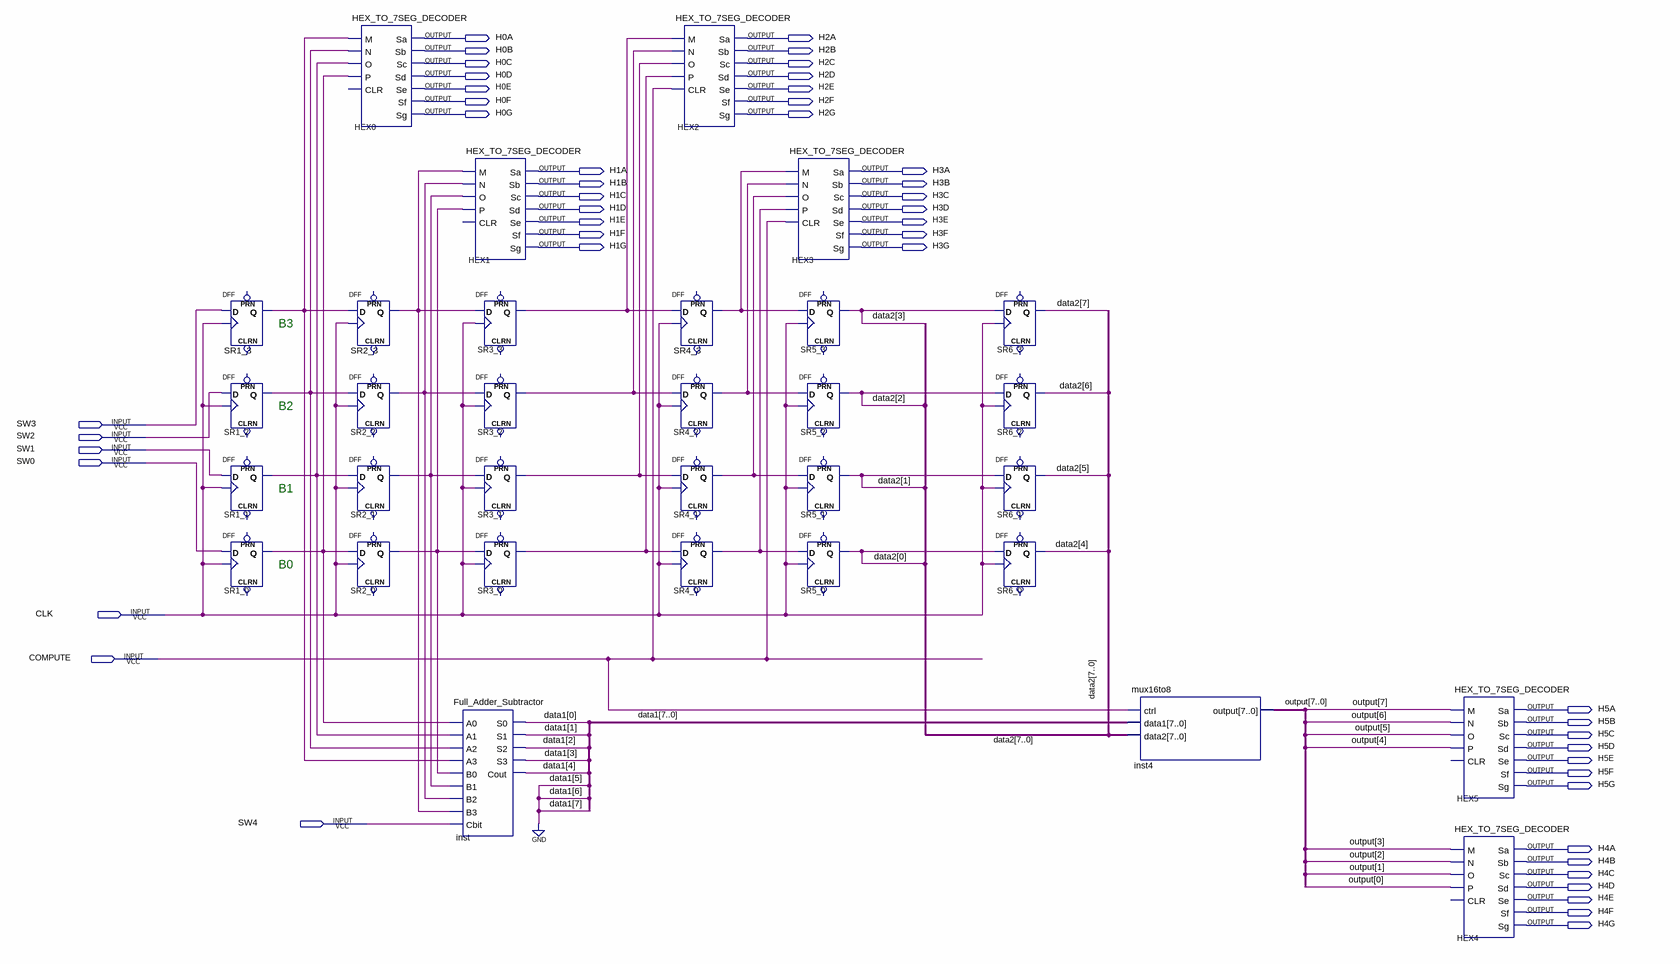
[diagram p0: schematic sheet]
// Quartus schematic ShiftRegister.bdf as structural Verilog: 32 symbols, 49 pins
module ShiftRegister (
  input  SW3,
  input  SW2,
  input  SW1,
  input  SW0,
  input  CLK,
  input  COMPUTE,
  input  SW4,
  output H0A,
  output H2A,
  output H0B,
  output H2B,
  output H0C,
  output H2C,
  output H0D,
  output H2D,
  output H0E,
  output H2E,
  output H0F,
  output H2F,
  output H0G,
  output H2G,
  output H1A,
  output H3A,
  output H1B,
  output H3B,
  output H1C,
  output H3C,
  output H1D,
  output H3D,
  output H1E,
  output H3E,
  output H1F,
  output H3F,
  output H1G,
  output H3G,
  output H5A,
  output H5B,
  output H5C,
  output H5D,
  output H5E,
  output H5F,
  output H5G,
  output H4A,
  output H4B,
  output H4C,
  output H4D,
  output H4E,
  output H4F,
  output H4G
);

  wire SR1_0_q, SR1_1_q, SR1_2_q, SR1_3_q, SR2_0_q, SR2_1_q, SR2_2_q, SR2_3_q, SR3_0_q, SR3_1_q, SR3_2_q,
       SR3_3_q, SR4_0_q, SR4_1_q, SR4_2_q, SR4_3_q;
  wire [4:0] data1;
  wire [7:0] data2, \output ;

  DFF SR1_3 (.CLK(CLK), .D(SW3), .Q(SR1_3_q));  // open: CLRN, PRN
  DFF SR1_2 (.CLK(CLK), .D(SW2), .Q(SR1_2_q));  // open: CLRN, PRN
  DFF SR1_1 (.CLK(CLK), .D(SW1), .Q(SR1_1_q));  // open: CLRN, PRN
  DFF SR1_0 (.CLK(CLK), .D(SW0), .Q(SR1_0_q));  // open: CLRN, PRN
  HEX_TO_7SEG_DECODER HEX0 (
    .M(SR1_3_q), .N(SR1_2_q), .O(SR1_1_q), .P(SR1_0_q), .Sa(H0A), .Sb(H0B), .Sc(H0C), .Sd(H0D), .Se(H0E),
    .Sf(H0F), .Sg(H0G));  // open: CLR
  DFF SR2_3 (.CLK(CLK), .D(SR1_3_q), .Q(SR2_3_q));  // open: CLRN, PRN
  DFF SR2_2 (.CLK(CLK), .D(SR1_2_q), .Q(SR2_2_q));  // open: CLRN, PRN
  DFF SR2_1 (.CLK(CLK), .D(SR1_1_q), .Q(SR2_1_q));  // open: CLRN, PRN
  DFF SR2_0 (.CLK(CLK), .D(SR1_0_q), .Q(SR2_0_q));  // open: CLRN, PRN
  HEX_TO_7SEG_DECODER HEX1 (
    .M(SR2_3_q), .N(SR2_2_q), .O(SR2_1_q), .P(SR2_0_q), .Sa(H1A), .Sb(H1B), .Sc(H1C), .Sd(H1D), .Se(H1E),
    .Sf(H1F), .Sg(H1G));  // open: CLR
  DFF SR3_3 (.CLK(CLK), .D(SR2_3_q), .Q(SR3_3_q));  // open: CLRN, PRN
  DFF SR3_2 (.CLK(CLK), .D(SR2_2_q), .Q(SR3_2_q));  // open: CLRN, PRN
  DFF SR3_1 (.CLK(CLK), .D(SR2_1_q), .Q(SR3_1_q));  // open: CLRN, PRN
  DFF SR3_0 (.CLK(CLK), .D(SR2_0_q), .Q(SR3_0_q));  // open: CLRN, PRN
  Full_Adder_Subtractor inst (
    .A0(SR1_0_q), .A1(SR1_1_q), .A2(SR1_2_q), .A3(SR1_3_q), .B0(SR2_0_q), .B1(SR2_1_q), .B2(SR2_2_q),
    .B3(SR2_3_q), .Cbit(SW4), .S0(data1[0]), .S1(data1[1]), .S2(data1[2]), .S3(data1[3]), .Cout(data1[4]));
  HEX_TO_7SEG_DECODER HEX2 (
    .M(SR3_3_q), .N(SR3_2_q), .O(SR3_1_q), .P(SR3_0_q), .CLR(COMPUTE), .Sa(H2A), .Sb(H2B), .Sc(H2C),
    .Sd(H2D), .Se(H2E), .Sf(H2F), .Sg(H2G));
  DFF SR4_3 (.CLK(CLK), .D(SR3_3_q), .Q(SR4_3_q));  // open: CLRN, PRN
  DFF SR4_2 (.CLK(CLK), .D(SR3_2_q), .Q(SR4_2_q));  // open: CLRN, PRN
  DFF SR4_1 (.CLK(CLK), .D(SR3_1_q), .Q(SR4_1_q));  // open: CLRN, PRN
  DFF SR4_0 (.CLK(CLK), .D(SR3_0_q), .Q(SR4_0_q));  // open: CLRN, PRN
  HEX_TO_7SEG_DECODER HEX3 (
    .M(SR4_3_q), .N(SR4_2_q), .O(SR4_1_q), .P(SR4_0_q), .CLR(COMPUTE), .Sa(H3A), .Sb(H3B), .Sc(H3C),
    .Sd(H3D), .Se(H3E), .Sf(H3F), .Sg(H3G));
  DFF SR5_3 (.CLK(CLK), .D(SR4_3_q), .Q(data2[3]));  // open: CLRN, PRN
  DFF SR5_2 (.CLK(CLK), .D(SR4_2_q), .Q(data2[2]));  // open: CLRN, PRN
  DFF SR5_1 (.CLK(CLK), .D(SR4_1_q), .Q(data2[1]));  // open: CLRN, PRN
  DFF SR5_0 (.CLK(CLK), .D(SR4_0_q), .Q(data2[0]));  // open: CLRN, PRN
  DFF SR6_3 (.CLK(CLK), .D(data2[3]), .Q(data2[7]));  // open: CLRN, PRN
  DFF SR6_2 (.CLK(CLK), .D(data2[2]), .Q(data2[6]));  // open: CLRN, PRN
  DFF SR6_1 (.CLK(CLK), .D(data2[1]), .Q(data2[5]));  // open: CLRN, PRN
  DFF SR6_0 (.CLK(CLK), .D(data2[0]), .Q(data2[4]));  // open: CLRN, PRN
  mux16to8 inst4 (.ctrl(COMPUTE), .data1({3'b000, data1}), .data2(data2), .\output (\output ));
  HEX_TO_7SEG_DECODER HEX5 (
    .M(\output [7]), .N(\output [6]), .O(\output [5]), .P(\output [4]), .Sa(H5A), .Sb(H5B), .Sc(H5C),
    .Sd(H5D), .Se(H5E), .Sf(H5F), .Sg(H5G));  // open: CLR
  HEX_TO_7SEG_DECODER HEX4 (
    .M(\output [3]), .N(\output [2]), .O(\output [1]), .P(\output [0]), .Sa(H4A), .Sb(H4B), .Sc(H4C),
    .Sd(H4D), .Se(H4E), .Sf(H4F), .Sg(H4G));  // open: CLR

  // Notes on the sheet:
  //   B3
  //   B2
  //   B1
  //   B0
endmodule
